# Altium schematic sheet io-devices.SchDoc
size A3; DocumentNumber: 15; SheetNumber: 15; SheetTotal: 45; SheetDescription: Smart Switches, Isolation Monitoring
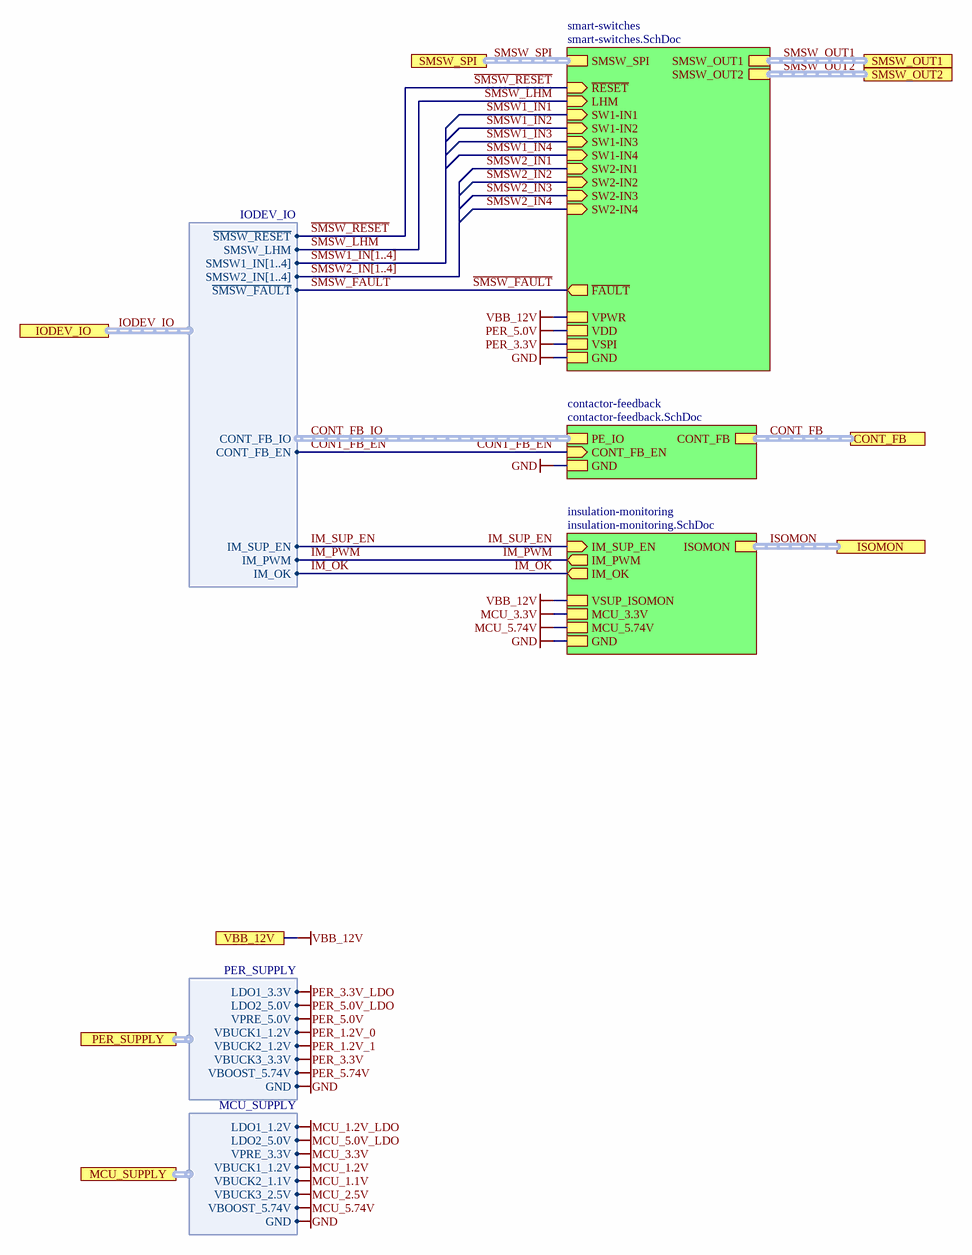
[diagram p0: io-devices.SchDoc]

## Sub-sheets
contactor-feedback = contactor-feedback.SchDoc: PE_IO (harness PE_IO), CONT_FB (harness PE_IO), GND, CONT_FB_EN (in)
insulation-monitoring = insulation-monitoring.SchDoc: GND, IM_SUP_EN (in), ISOMON (harness ISOMON), VSUP_ISOMON, IM_PWM (out), IM_OK (out), MCU_3.3V, MCU_5.74V
smart-switches = smart-switches.SchDoc: ~{RESET} (in), LHM (in), ~{FAULT} (out), SMSW_SPI (harness SPI), SMSW_OUT2 (harness SMSW_OUT), SMSW_OUT1 (harness SMSW_OUT), SW1-IN4 (in), SW2-IN2 (in), SW1-IN1 (in), SW2-IN3 (in), SW1-IN3 (in), SW1-IN2 (in), SW2-IN4 (in), SW2-IN1 (in), GND, VDD, VPWR, VSPI

## Ports
CONT_FB (harness PE_IO), IODEV_IO (harness IODEV_IO), ISOMON (harness ISOMON), MCU_SUPPLY (harness MCU_SUPPLY), PER_SUPPLY (harness PER_SUPPLY), SMSW_OUT1 (harness SMSW_OUT), SMSW_OUT2 (harness SMSW_OUT), SMSW_SPI (harness SPI), VBB_12V

## Harnesses
IODEV_IO: ~{SMSW_RESET}, SMSW_LHM, ~{SMSW_FAULT}, CONT_FB_IO, CONT_FB_EN, IM_SUP_EN, IM_PWM, IM_OK, SMSW1_IN[1..4], SMSW2_IN[1..4]
PER_SUPPLY: GND, VBOOST_5.74V, LDO1_3.3V, LDO2_5.0V, VPRE_5.0V, VBUCK1_1.2V, VBUCK2_1.2V, VBUCK3_3.3V
MCU_SUPPLY: VBUCK1_1.2V, VBUCK2_1.1V, VBUCK3_2.5V, LDO1_1.2V, LDO2_5.0V, GND, VPRE_3.3V, VBOOST_5.74V

## Nets
GND: sheet smart-switches/GND, sheet contactor-feedback/GND, sheet insulation-monitoring/GND, port PER_SUPPLY.GND, port MCU_SUPPLY.GND
MCU_1.1V: port MCU_SUPPLY.VBUCK2_1.1V
MCU_1.2V: port MCU_SUPPLY.VBUCK1_1.2V
MCU_1.2V_LDO: port MCU_SUPPLY.LDO1_1.2V
MCU_2.5V: port MCU_SUPPLY.VBUCK3_2.5V
MCU_3.3V: sheet insulation-monitoring/MCU_3.3V, port MCU_SUPPLY.VPRE_3.3V
MCU_5.0V_LDO: port MCU_SUPPLY.LDO2_5.0V
MCU_5.74V: sheet insulation-monitoring/MCU_5.74V, port MCU_SUPPLY.VBOOST_5.74V
PER_1.2V_0: port PER_SUPPLY.VBUCK1_1.2V
PER_1.2V_1: port PER_SUPPLY.VBUCK2_1.2V
PER_3.3V: sheet smart-switches/VSPI, port PER_SUPPLY.VBUCK3_3.3V
PER_3.3V_LDO: port PER_SUPPLY.LDO1_3.3V
PER_5.0V: sheet smart-switches/VDD, port PER_SUPPLY.VPRE_5.0V
PER_5.0V_LDO: port PER_SUPPLY.LDO2_5.0V
PER_5.74V: port PER_SUPPLY.VBOOST_5.74V
VBB_12V: port VBB_12V, sheet smart-switches/VPWR, sheet insulation-monitoring/VSUP_ISOMON
~{SMSW_FAULT}: sheet smart-switches/~{FAULT}, port IODEV_IO.~{SMSW_FAULT}
~{SMSW_RESET}: sheet smart-switches/~{RESET}, port IODEV_IO.~{SMSW_RESET}
CONT_FB_EN: sheet contactor-feedback/CONT_FB_EN, port IODEV_IO.CONT_FB_EN
IM_OK: sheet insulation-monitoring/IM_OK, port IODEV_IO.IM_OK
IM_PWM: sheet insulation-monitoring/IM_PWM, port IODEV_IO.IM_PWM
IM_SUP_EN: sheet insulation-monitoring/IM_SUP_EN, port IODEV_IO.IM_SUP_EN
SMSW1_IN1: sheet smart-switches/SW1-IN1
SMSW1_IN2: sheet smart-switches/SW1-IN2
SMSW1_IN3: sheet smart-switches/SW1-IN3
SMSW1_IN4: sheet smart-switches/SW1-IN4
SMSW2_IN1: sheet smart-switches/SW2-IN1
SMSW2_IN2: sheet smart-switches/SW2-IN2
SMSW2_IN3: sheet smart-switches/SW2-IN3
SMSW2_IN4: sheet smart-switches/SW2-IN4
SMSW_LHM: sheet smart-switches/LHM, port IODEV_IO.SMSW_LHM  [project net IODEV_IO.SMSW_LHM]

## Buses and harness runs
bus SMSW1_IN[1..4]
bus SMSW2_IN[1..4]
harness CONT_FB = port CONT_FB = sheet contactor-feedback/CONT_FB
harness CONT_FB_IO = sheet contactor-feedback/PE_IO
harness IODEV_IO = port IODEV_IO
harness ISOMON = port ISOMON = sheet insulation-monitoring/ISOMON
harness SMSW_OUT1 = port SMSW_OUT1 = sheet smart-switches/SMSW_OUT1
harness SMSW_OUT2 = port SMSW_OUT2 = sheet smart-switches/SMSW_OUT2
harness SMSW_SPI = port SMSW_SPI = sheet smart-switches/SMSW_SPI

## Notes on the sheet
- Fraunhofer IISB
- Schottkystr. 10
- developed by:
- 91058 Erlangen
- Germany
- Author
- Project
- License
- Description
- File
- Version
- Release Date
- Sheet
- foxbms.org <https://foxbms.org>
- www.iisb.fraunhofer.de <https://www.iisb.fraunhofer.de/>
- foxBMS Team
- /